# Altium schematic sheet SSR IO.SchDoc: document title
size C; ApprovedBy: Vincent Himpe; CheckedBy: Vincent Himpe; Author: Vincent Himpe; CompanyName: STMicroelectronics; DrawnBy: Vincent Himpe; Organization: BCD Application; Address1: 2525 Augustine Drive; Address2: Santa Clara 95054 CA; Address3: USA; Revision: A; Project: Project title; DrawnByContact: +1 (408) 451 8116; DrawnByEmail: vincent.himpe@st.com
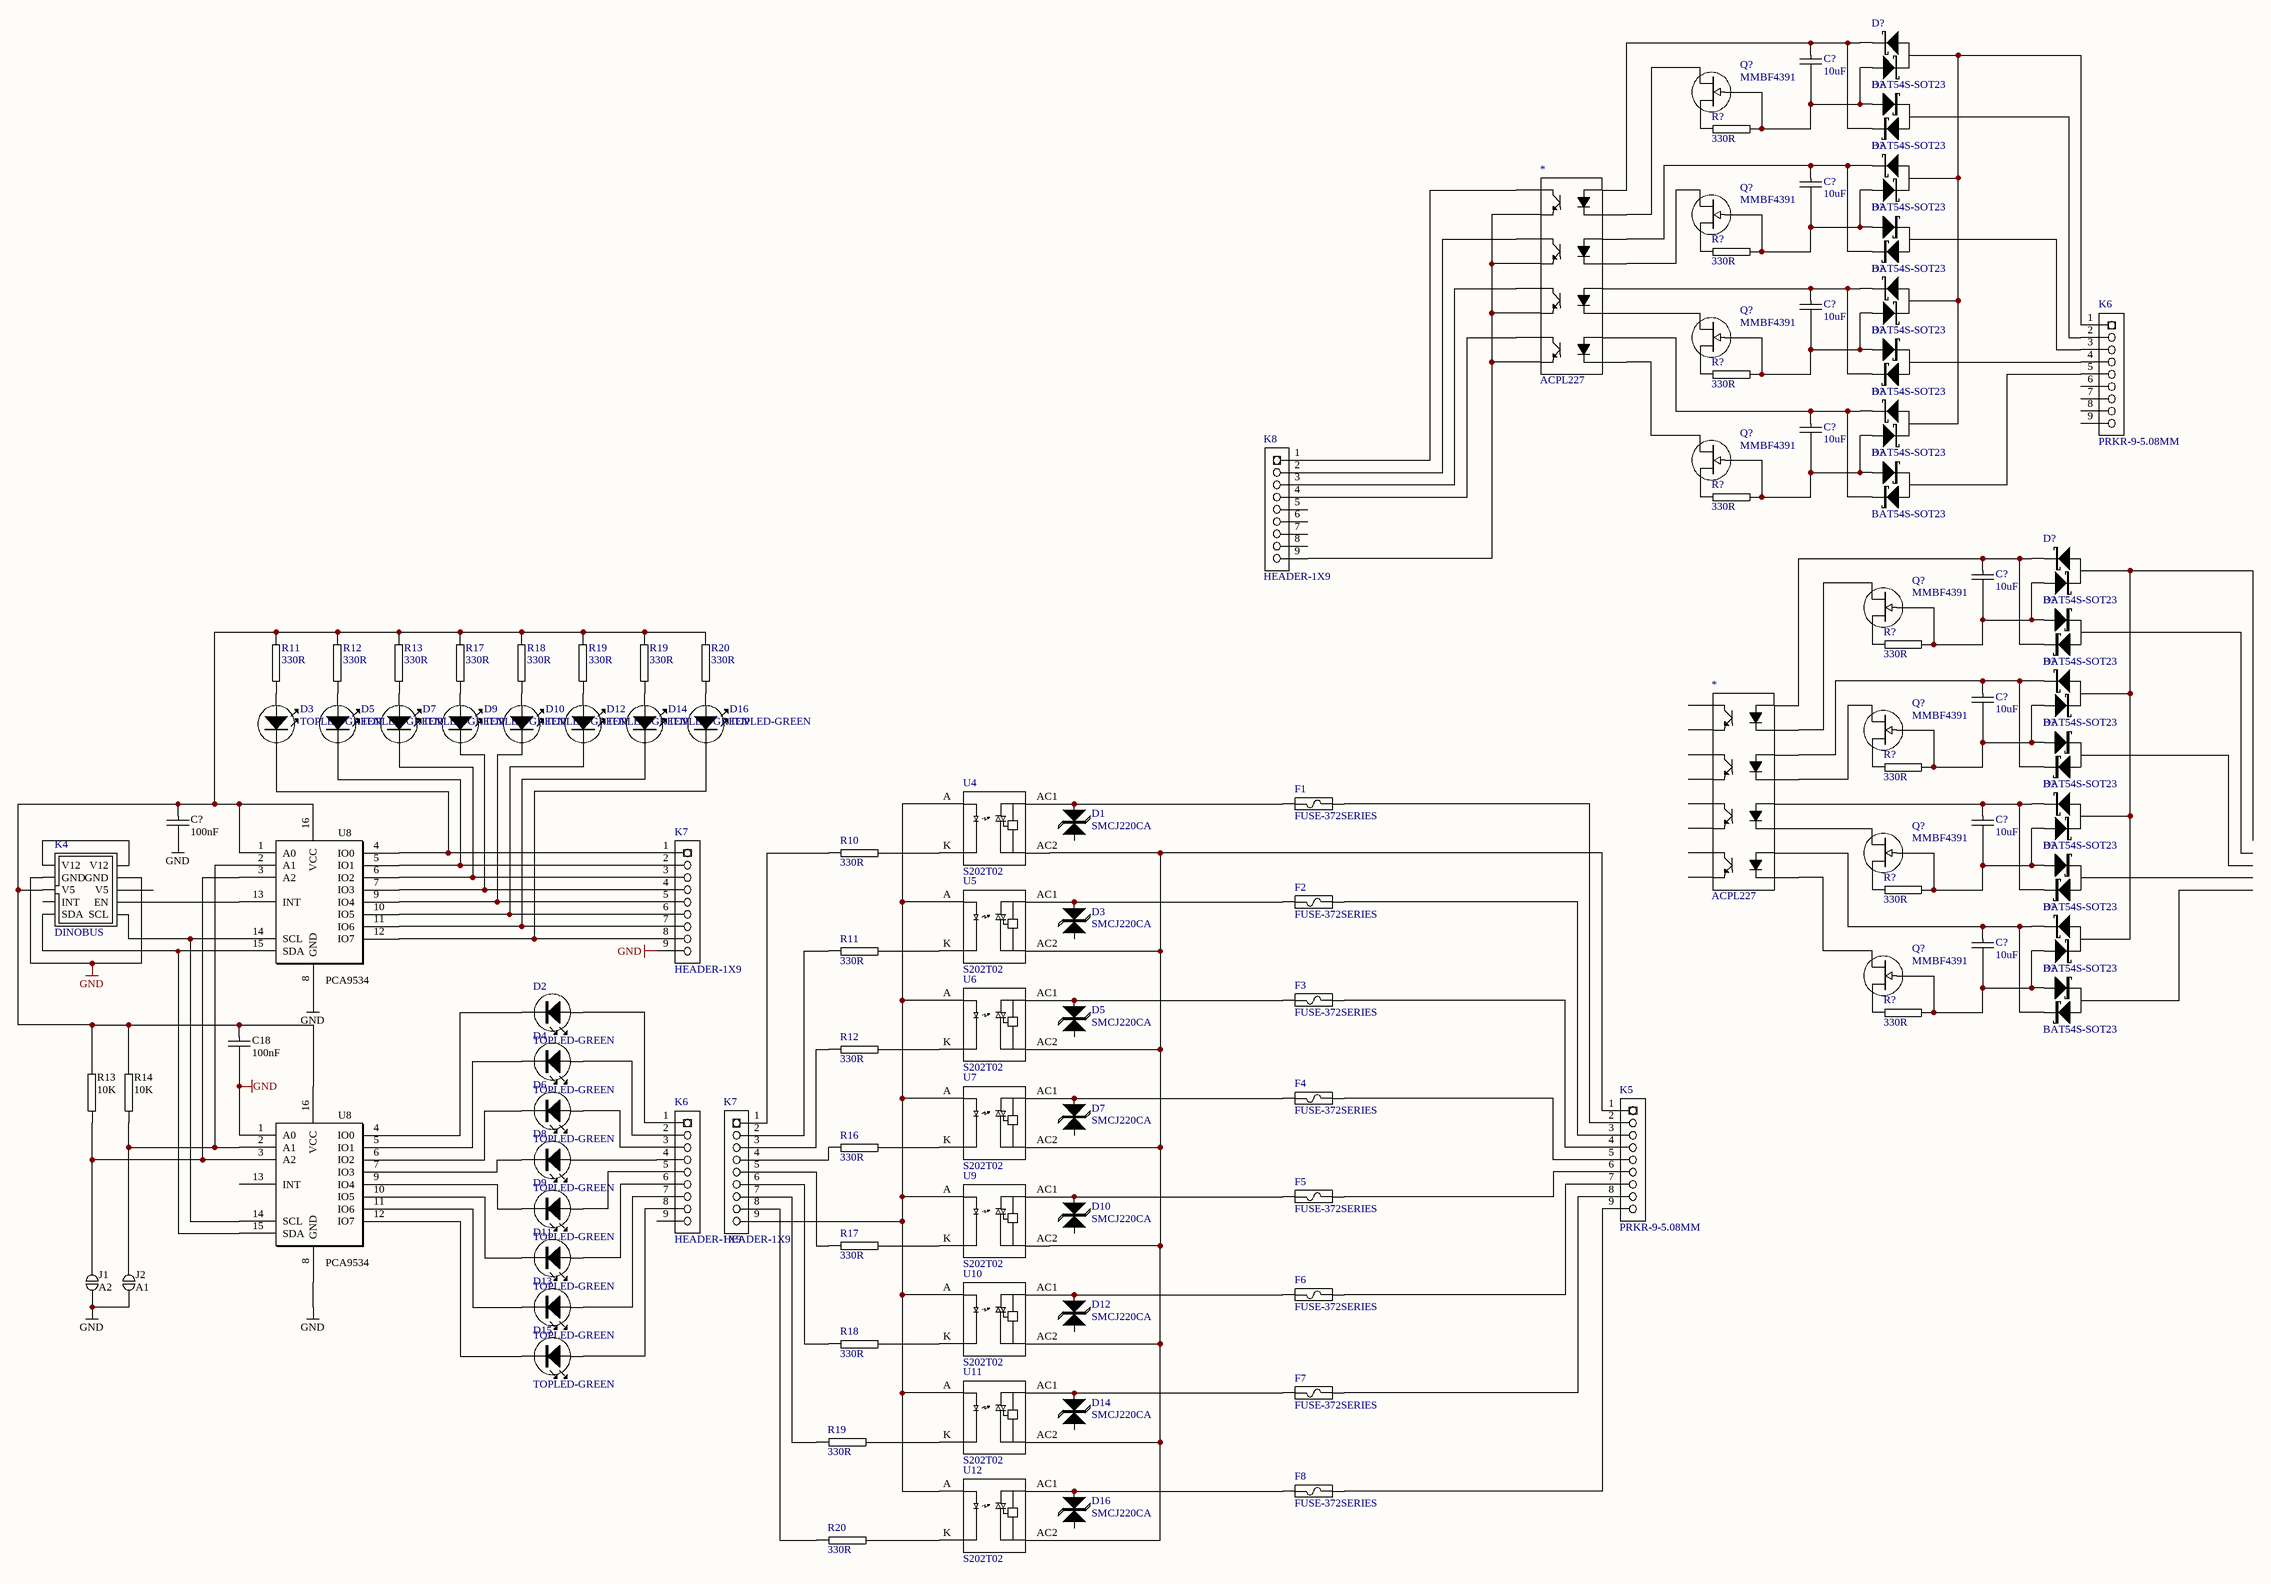
[diagram p0: SSR IO.SchDoc]

## Parts
(Parts that share a designator on the sheet are numbered #1, #2 ... from top to bottom, then left to right.)
*#1  ACPL227  [Model Name]
*#2  ACPL227  [Model Name]
C18  100nF  [0805C]
C?#1  10uF  [1210C-GENERIC]
C?#2  10uF  [1210C-GENERIC]
C?#3  10uF  [1210C-GENERIC]
C?#4  10uF  [1210C-GENERIC]
C?#5  10uF  [1210C-GENERIC]
C?#6  10uF  [1210C-GENERIC]
C?#7  100nF  [0805C]
C?#8  10uF  [1210C-GENERIC]
C?#9  10uF  [1210C-GENERIC]
D1  SMCJ220CA  [DIODE-SMC]
D2  TOPLED-GREEN  [TOPLED-GREEN]
D3#1  TOPLED-GREEN  [TOPLED-GREEN]
D3#2  SMCJ220CA  [DIODE-SMC]
D4  TOPLED-GREEN  [TOPLED-GREEN]
D5#1  TOPLED-GREEN  [TOPLED-GREEN]
D5#2  SMCJ220CA  [DIODE-SMC]
D6  TOPLED-GREEN  [TOPLED-GREEN]
D7#1  TOPLED-GREEN  [TOPLED-GREEN]
D7#2  SMCJ220CA  [DIODE-SMC]
D8  TOPLED-GREEN  [TOPLED-GREEN]
D9#1  TOPLED-GREEN  [TOPLED-GREEN]
D9#2  TOPLED-GREEN  [TOPLED-GREEN]
D10#1  TOPLED-GREEN  [TOPLED-GREEN]
D10#2  SMCJ220CA  [DIODE-SMC]
D11  TOPLED-GREEN  [TOPLED-GREEN]
D12#1  TOPLED-GREEN  [TOPLED-GREEN]
D12#2  SMCJ220CA  [DIODE-SMC]
D13  TOPLED-GREEN  [TOPLED-GREEN]
D14#1  TOPLED-GREEN  [TOPLED-GREEN]
D14#2  SMCJ220CA  [DIODE-SMC]
D15  TOPLED-GREEN  [TOPLED-GREEN]
D16#1  TOPLED-GREEN  [TOPLED-GREEN]
D16#2  SMCJ220CA  [DIODE-SMC]
D?#1  BAT54S-SOT23  [SOT23-123]
D?#2  BAT54S-SOT23  [SOT23-123]
D?#3  BAT54S-SOT23  [SOT23-123]
D?#4  BAT54S-SOT23  [SOT23-123]
D?#5  BAT54S-SOT23  [SOT23-123]
D?#6  BAT54S-SOT23  [SOT23-123]
D?#7  BAT54S-SOT23  [SOT23-123]
D?#8  BAT54S-SOT23  [SOT23-123]
D?#9  BAT54S-SOT23  [SOT23-123]
D?#10  BAT54S-SOT23  [SOT23-123]
D?#11  BAT54S-SOT23  [SOT23-123]
D?#12  BAT54S-SOT23  [SOT23-123]
D?#13  BAT54S-SOT23  [SOT23-123]
D?#14  BAT54S-SOT23  [SOT23-123]
D?#15  BAT54S-SOT23  [SOT23-123]
D?#16  BAT54S-SOT23  [SOT23-123]
F1  FUSE-372SERIES  [FUSE-372]
F2  FUSE-372SERIES  [FUSE-372]
F3  FUSE-372SERIES  [FUSE-372]
F4  FUSE-372SERIES  [FUSE-372]
F5  FUSE-372SERIES  [FUSE-372]
F6  FUSE-372SERIES  [FUSE-372]
F7  FUSE-372SERIES  [FUSE-372]
F8  FUSE-372SERIES  [FUSE-372]
J1  A2  [BYPASS]
J2  A1  [BYPASS]
K4  DINOBUS  [IDC10-B]
K5  PRKR-9-5.08MM  [PRKR-9-5.08MM]
K6#1  PRKR-9-5.08MM  [PRKR-9-5.08MM]
K6#2  HEADER-1X9  [HEADER-1X9]
K7#1  HEADER-1X9  [HEADER-1X9]
K7#2  HEADER-1X9  [HEADER-1X9]
K8  HEADER-1X9  [HEADER-1X9]
Q?#1  MMBF4391  [SOT23-DSG]
Q?#2  MMBF4391  [SOT23-DSG]
Q?#3  MMBF4391  [SOT23-DSG]
Q?#4  MMBF4391  [SOT23-DSG]
Q?#5  MMBF4391  [SOT23-DSG]
Q?#6  MMBF4391  [SOT23-DSG]
Q?#7  MMBF4391  [SOT23-DSG]
Q?#8  MMBF4391  [SOT23-DSG]
R10  330R  [0805R-330]
R11#1  330R  [0805R-330]
R11#2  330R  [0805R-330]
R12#1  330R  [0805R-330]
R12#2  330R  [0805R-330]
R13#1  330R  [0805R-330]
R13#2  10K  [0805R]
R14  10K  [0805R]
R16  330R  [0805R-330]
R17#1  330R  [0805R-330]
R17#2  330R  [0805R-330]
R18#1  330R  [0805R-330]
R18#2  330R  [0805R-330]
R19#1  330R  [0805R-330]
R19#2  330R  [0805R-330]
R19#3  330R  [0805R-330]
R20#1  330R  [0805R-330]
R20#2  330R  [0805R-330]
R?#1  330R  [0805R-330]
R?#2  330R  [0805R-330]
R?#3  330R  [0805R-330]
R?#4  330R  [0805R-330]
R?#5  330R  [0805R-330]
R?#6  330R  [0805R-330]
R?#7  330R  [0805R-330]
R?#8  330R  [0805R-330]
U4  S202T02  [S202T02]
U5  S202T02  [S202T02]
U6  S202T02  [S202T02]
U7  S202T02  [S202T02]
U8#1  PCA9534  [SO16W]
U8#2  PCA9534  [SO16W]
U9  S202T02  [S202T02]
U10  S202T02  [S202T02]
U11  S202T02  [S202T02]
U12  S202T02  [S202T02]

## Nets
GND: C18.2 C?#7.2 J1.2 J2.2 K4.3(GND) K4.4(GND) K7#1.9 U8#1.8(GND) U8#2.1(A0) U8#2.8(GND)
Net*#1_1: *#1.1(A1) C?#1.1 D?#1.2 D?#2.2
Net*#1_2: *#1.2(K1) Q?#1.D
Net*#1_3: *#1.3(A2) C?#2.1 D?#3.2 D?#4.2
Net*#1_4: *#1.4(K2) Q?#2.D
Net*#1_5: *#1.5(A3) C?#3.1 D?#5.2 D?#6.2
Net*#1_6: *#1.6(K3) Q?#3.D
Net*#1_7: *#1.7(A4) C?#4.1 D?#7.2 D?#8.2
Net*#1_8: *#1.8(K4) Q?#4.D
Net*#1_9: *#1.9(E4) *#1.11(E3) *#1.13(E2) *#1.15(E1) K8.9
Net*#1_10: *#1.10(C4) K8.4
Net*#1_12: *#1.12(C3) K8.3
Net*#1_14: *#1.14(C2) K8.2
Net*#1_16: *#1.16(C1) K8.1
Net*#2_1: *#2.1(A1) C?#5.1 D?#9.2 D?#10.2
Net*#2_2: *#2.2(K1) Q?#5.D
Net*#2_3: *#2.3(A2) C?#6.1 D?#11.2 D?#12.2
Net*#2_4: *#2.4(K2) Q?#6.D
Net*#2_5: *#2.5(A3) C?#8.1 D?#13.2 D?#14.2
Net*#2_6: *#2.6(K3) Q?#7.D
Net*#2_7: *#2.7(A4) C?#9.1 D?#15.2 D?#16.2
Net*#2_8: *#2.8(K4) Q?#8.D
NetC18_1: C18.1 C?#7.1 K4.5(V5) R11#1.2 R12#1.2 R13#1.2 R13#2.2 R14.2 R17#1.2 R18#1.2 R19#1.2 R19#2.2 R20#1.2 U8#1.1(A0) U8#1.16(VCC) U8#2.16(VCC)
NetC?#1_2: C?#1.2 D?#1.1 D?#2.1 Q?#1.G R?#1.2
NetC?#2_2: C?#2.2 D?#3.1 D?#4.1 Q?#2.G R?#2.2
NetC?#3_2: C?#3.2 D?#5.1 D?#6.1 Q?#3.G R?#3.2
NetC?#4_2: C?#4.2 D?#7.1 D?#8.1 Q?#4.G R?#4.2
NetC?#5_2: C?#5.2 D?#9.1 D?#10.1 Q?#5.G R?#5.2
NetC?#6_2: C?#6.2 D?#11.1 D?#12.1 Q?#6.G R?#6.2
NetC?#8_2: C?#8.2 D?#13.1 D?#14.1 Q?#7.G R?#7.2
NetC?#9_2: C?#9.2 D?#15.1 D?#16.1 Q?#8.G R?#8.2
NetD1_K: D1.K F1.2 U4.AC1
NetD2_A: D2.A K6#2.1
NetD2_K: D2.K U8#2.4(IO0)
NetD3#1_A: D3#1.A R11#1.1
NetD3#1_K: D3#1.K K7#1.1 U8#1.4(IO0)
NetD3#2_K: D3#2.K F2.2 U5.AC1
NetD4_A: D4.A K6#2.2
NetD4_K: D4.K U8#2.5(IO1)
NetD5#1_A: D5#1.A R12#1.1
NetD5#1_K: D5#1.K K7#1.2 U8#1.5(IO1)
NetD5#2_K: D5#2.K F3.2 U6.AC1
NetD6_A: D6.A K6#2.3
NetD6_K: D6.K U8#2.6(IO2)
NetD7#1_A: D7#1.A R13#1.1
NetD7#1_K: D7#1.K K7#1.3 U8#1.6(IO2)
NetD7#2_K: D7#2.K F4.2 U7.AC1
NetD8_A: D8.A K6#2.4
NetD8_K: D8.K U8#2.7(IO3)
NetD9#1_A: D9#1.A R17#1.1
NetD9#1_K: D9#1.K K7#1.4 U8#1.7(IO3)
NetD9#2_A: D9#2.A K6#2.5
NetD9#2_K: D9#2.K U8#2.9(IO4)
NetD10#1_A: D10#1.A R18#1.1
NetD10#1_K: D10#1.K K7#1.5 U8#1.9(IO4)
NetD10#2_K: D10#2.K F5.2 U9.AC1
NetD11_A: D11.A K6#2.6
NetD11_K: D11.K U8#2.10(IO5)
NetD12#1_A: D12#1.A R19#1.1
NetD12#1_K: D12#1.K K7#1.6 U8#1.10(IO5)
NetD12#2_K: D12#2.K F6.2 U10.AC1
NetD13_A: D13.A K6#2.7
NetD13_K: D13.K U8#2.11(IO6)
NetD14#1_A: D14#1.A R19#2.1
NetD14#1_K: D14#1.K K7#1.7 U8#1.11(IO6)
NetD14#2_K: D14#2.K F7.2 U11.AC1
NetD15_A: D15.A K6#2.8
NetD15_K: D15.K U8#2.12(IO7)
NetD16#1_A: D16#1.A R20#1.1
NetD16#1_K: D16#1.K K7#1.8 U8#1.12(IO7)
NetD16#2_K: D16#2.K F8.2 U12.AC1
NetD?#1_3: D?#1.3 D?#3.3 D?#5.3 D?#7.3 K6#1.1
NetD?#2_3: D?#2.3 K6#1.2
NetD?#4_3: D?#4.3 K6#1.3
NetD?#6_3: D?#6.3 K6#1.4
NetD?#8_3: D?#8.3 K6#1.5
NetD?#9_3: D?#9.3 D?#11.3 D?#13.3 D?#15.3
NetF1_1: F1.1 K5.2
NetF2_1: F2.1 K5.3
NetF3_1: F3.1 K5.4
NetF4_1: F4.1 K5.5
NetF5_1: F5.1 K5.6
NetF6_1: F6.1 K5.7
NetF7_1: F7.1 K5.8
NetF8_1: F8.1 K5.9
NetJ1_1: J1.1 R13#2.1 U8#1.3(A2) U8#2.3(A2)
NetJ2_1: J2.1 R14.1 U8#1.2(A1) U8#2.2(A1)
NetK4_1: K4.1(V12) K4.2(V12)
NetK4_8: K4.8(EN) U8#1.13(INT)
NetK4_9: K4.9(SDA) U8#1.15(SDA) U8#2.15(SDA)
NetK4_10: K4.10(SCL) U8#1.14(SCL) U8#2.14(SCL)
NetK5_1: K5.1 U4.AC2 U5.AC2 U6.AC2 U7.AC2 U9.AC2 U10.AC2 U11.AC2 U12.AC2
NetK7#2_1: K7#2.1 R10.1
NetK7#2_2: K7#2.2 R11#2.1
NetK7#2_3: K7#2.3 R12#2.1
NetK7#2_4: K7#2.4 R16.1
NetK7#2_5: K7#2.5 R17#2.1
NetK7#2_6: K7#2.6 R18#2.1
NetK7#2_7: K7#2.7 R19#3.1
NetK7#2_8: K7#2.8 R20#2.1
NetK7#2_9: K7#2.9 U4.A U5.A U6.A U7.A U9.A U10.A U11.A U12.A
NetQ?#1_S: Q?#1.S R?#1.1
NetQ?#2_S: Q?#2.S R?#2.1
NetQ?#3_S: Q?#3.S R?#3.1
NetQ?#4_S: Q?#4.S R?#4.1
NetQ?#5_S: Q?#5.S R?#5.1
NetQ?#6_S: Q?#6.S R?#6.1
NetQ?#7_S: Q?#7.S R?#7.1
NetQ?#8_S: Q?#8.S R?#8.1
NetR10_2: R10.2 U4.K
NetR11#2_2: R11#2.2 U5.K
NetR12#2_2: R12#2.2 U6.K
NetR16_2: R16.2 U7.K
NetR17#2_2: R17#2.2 U9.K
NetR18#2_2: R18#2.2 U10.K
NetR19#3_2: R19#3.2 U11.K
NetR20#2_2: R20#2.2 U12.K

Not connected (* = marked no-connect by the designer): *#2 9(E4) 10(C4) 11(E3) 12(C3) 13(E2) 14(C2) 15(E1) 16(C1); D1 A; D3#2 A; D5#2 A; D7#2 A; D10#2 A; D12#2 A; D14#2 A; D16#2 A; D?#10 3; D?#12 3; D?#14 3; D?#16 3; K4 6(V5) 7(INT); K6#1 6 7 8 9; K6#2 9; K8 5 6 7 8; U8#2 13(INT)

## Notes on the sheet
- PROJECT
- STMicroelectronics
- Last Modified
- Sheet
- of
- Document
- Revision
- Drawn By
- Information in this document is the intellectual property of STMicroelectronics.Disclosure outside of STMicroelectronics is prohibited without prior written approval. Contents may be subject to Patent or Patent application.
- 2525 Augustine Drive
- Santa Clara 95054 CA
- USA

## Library data of the parts
C18 C?#7 = 0805C-100NF: CAPACITOR NONPOLARISED
C?#1-C?#6 C?#8 C?#9 = 1210C-10UF-50V-TDK: GENERIC CAPACITOR NON POLARISED 1210; REEL: C87; Supplier 1: Digi-Key; Supplier Part Number 1: 445-4537-2-ND
D1 D3#2 D5#2 D7#2 D10#2 D12#2 D14#2 D16#2 = SMCJ220CA: Transient Surpression Diode TVS; Supplier 1: Digi-Key; Supplier Part Number 1: SMCJ220CALFCT-ND
D?#1-D?#16 = BAT54S-SOT23: DUAL SCHOTTKY DIODE SERIES; Manufacturer Part Number: BAT54S,215; Manufacturer: NXP Semiconductors; Voltage - DC Reverse (Vr) (Max): 30V; Speed: Small Signal =< 200mA (Io), Any Speed; Current - Reverse Leakage @ Vr: 2µA @ 25V; Diode Configuration: 1 Pair Series Connection; Voltage - Forward (Vf) (Max) @ If: 800mV @ 100mA; Current - Average Rectified (Io) (per Diode): 200mA (DC); Reverse Recovery Time (trr): 5ns; Description: DIODE SCHOTTKY 30V DUAL SOT23; Supplier 1: Digi-Key; Supplier Part Number 1: 568-1614-1-ND; Diode Type: Schottky; Package / Case: SOT-23-3, TO-236-3, Micro3™, SSD3, SST3; Packaging: Cut Tape (CT); Mounting Type: Surface Mount; Supplier Part Number: 568-1614-1-ND; RoHS: RoHS Compliant; Supplier: Digi-Key; Category: Discrete Semiconductor Products
F1-F8 = FUSE-372SERIES: FUSE-372
J1 J2 = BYPASS
K4 = DINOBUS: BOXHEADER 10 PIN; Manufacturer: Assmann Electronics Inc; Manufacturer Part Number: AWHW10G-0202-T-R; Connector Type: Header, Shrouded; Description: CONN HEADER LOW-PRO 10POS GOLD; Number of Positions: 10; Number of Positions Loaded: All; Pitch: 0.100" (2.54mm); Supplier 1: Digi-Key; Supplier Part Number 1: HRP10H-ND; Supplier: Digi-Key; Contact Type: Male Pin; RoHS: RoHS Compliant; Supplier Part Number: HRP10H-ND; Category: Connectors, Interconnects; Number of Rows: 2; Row Spacing: 0.100" (2.54mm); Contact Mating Length: -; Mounting Type: Through Hole; Termination: Solder; Fastening Type: -; Features: -; Contact Finish: Gold; Contact Finish Thickness: Flash; Color: Gray; Packaging: Tray
R10 R11#1 R11#2 R12#1 R12#2 R13#1 R16 R17#1 R17#2 R18#1 R18#2 R19#1-R19#3 R20#1 R20#2 R?#1-R?#8 = 0805R-330: RESISTOR 0805 1/4 WATT THIN FILM; Reel: *
R13#2 R14 = 0805R-10K: RESISTOR VALUE AS INDICATED
U8#1 U8#2 = PCA9534: OCTAL PUSH PULL DRIVER I2C
*#1 *#2 = ACPL227: Supplier 1: Mouser; Supplier Part Number 1: 630-ACPL-227-50BE
K5 K6#1 = PRKR-9-5.08MM: Supplier 1: Digi-Key; Supplier Part Number 1: S1011E-36-ND
K6#2 K7#1 K7#2 K8 = HEADER-1X9: Supplier 1: Digi-Key; Supplier Part Number 1: S1011E-36-ND
Q?#1-Q?#8 = MMBF4391: Supplier 1: Digi-Key; Supplier Part Number 1: MMBF4391LT1OSCT-ND
U4-U7 U9-U12 = S202T02: Supplier 1: Digi-Key; Supplier Part Number 1: 425-2374-5-ND